# Altium schematic sheet Irrigation_ArduinoNode_v1.SchDoc
size 420 x 297 mm; SheetNumber: 1; SheetTotal: 1; SPICEModelCacheKOELNJHK: <root> / <DocumentId>KOELNJHK</DocumentId> / <CacheFrame Number="0"> / <Model Name="diode" Kind="MDL"> / <Text>*Default Diode / *Diode Pinout: A,K / .MODEL DIODE D()</Text> / </Model> / </CacheFrame> / </root>
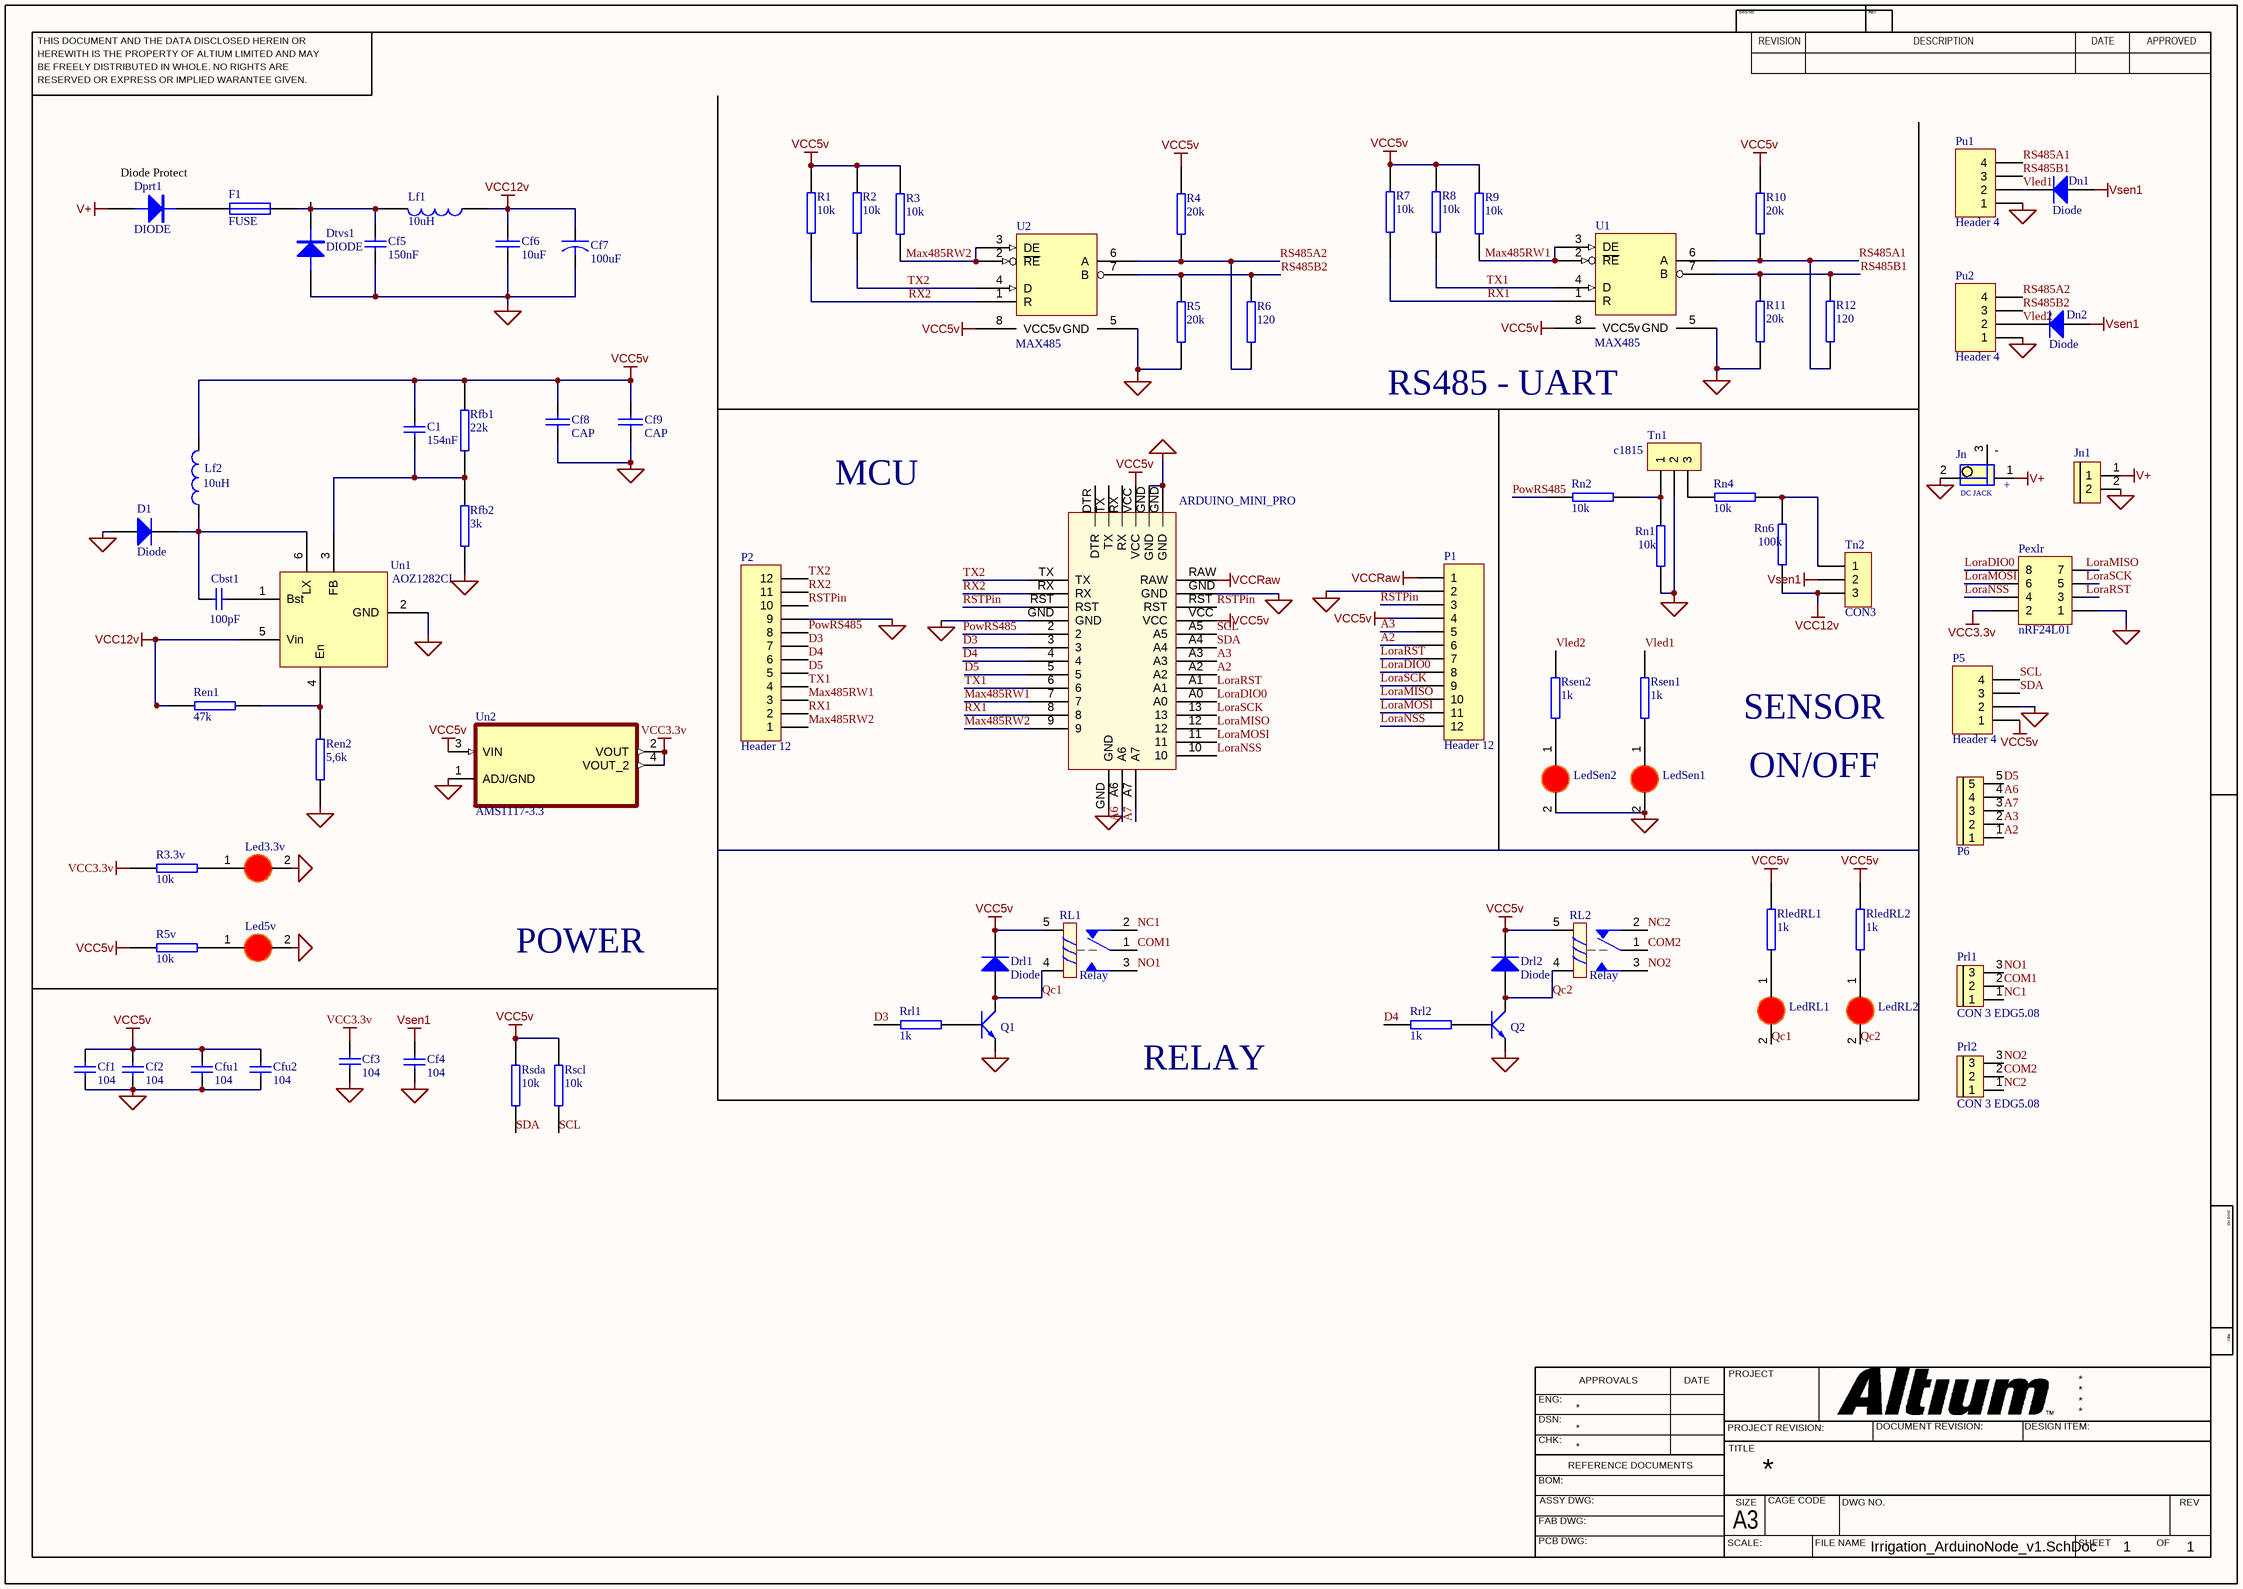
[diagram p0: Irrigation_ArduinoNode_v1.SchDoc]

## Parts
ARDUINO_MINI_PRO  (no value)  [ARDUINO_MINI_PRO]
C1  value 154nF  [0805c]
Cbst1  value 100pF  [0805c]
Cf1  104  [0805c]
Cf2  104  [0805c]
Cf3  104  [0805c]
Cf4  104  [0805c]
Cf5  value 150nF  [0805c]
Cf6  10uF  [1206e]
Cf7  100uF  [cc15r15]
Cf8  CAP  [1206e]
Cf9  CAP  [1206e]
Cfu1  104  [0805c]
Cfu2  104  [0805c]
D1  Diode  [Sma]
Dn1  Diode  [Sma]
Dn2  Diode  [Sma]
Dprt1  DIODE  [sma]
Drl1  Diode  [Sma]
Drl2  Diode  [Sma]
Dtvs1  DIODE  [smb]
F1  FUSE  [1812E]
Jn  (no value)  [CON3_129_PJ-002A_TH_RA]
Jn1  (no value)  [CON 2 HT3.96]
Led3.3v  (no value)  [LED-1206-Red]
Led5v  (no value)  [LED-1206-Red]
LedRL1  (no value)  [LED-1206-Red]
LedRL2  (no value)  [LED-1206-Red]
LedSen1  (no value)  [LED-1206-Red]
LedSen2  (no value)  [LED-1206-Red]
Lf1  10uH  [IND_SPR05x]
Lf2  value 10uH  [IND_SPR06xe]
P1  Header 12  [HDR1X12]
P2  Header 12  [HDR1X12]
P5  Header 4  [giacdung4]
P6  CON 5 EDG5.08  [CON 5 5EDG5.08]  (value not drawn)
Pexlr  nRF24L01  [HDR2X4]
Prl1  CON 3 EDG5.08  [CON 3 3EDG5.08]
Prl2  CON 3 EDG5.08  [CON 3 3EDG5.08]
Pu1  Header 4  [giacdung4]
Pu2  Header 4  [giacdung4]
Q1  (no value)  [SOT23-3]
Q2  (no value)  [SOT23-3]
R1  10k  [0805c]
R2  10k  [0805c]
R3  10k  [0805c]
R3.3v  10k  [0805c]
R4  20k  [0805c]
R5  20k  [0805c]
R5v  10k  [0805c]
R6  120  [0805c]
R7  10k  [0805c]
R8  10k  [0805c]
R9  10k  [0805c]
R10  20k  [0805c]
R11  20k  [0805c]
R12  120  [0805c]
Ren1  47k  [0805c]
Ren2  5,6k  [0805c]
Rfb1  22k  [0805c]
Rfb2  3k  [0805c]
RL1  Relay  [Relay 5 Chan SRD]
RL2  Relay  [Relay 5 Chan SRD]
RledRL1  1k  [0805c]
RledRL2  1k  [0805c]
Rn1  10k  [0805c]
Rn2  10k  [0805c]
Rn4  10k  [0805c]
Rn6  100k  [0805c]
Rrl1  1k  [0805c]
Rrl2  1k  [0805c]
Rscl  10k  [0805c]
Rsda  10k  [0805c]
Rsen1  1k  [0805c]
Rsen2  1k  [0805c]
Tn1  c1815  [sot23-3]
Tn2  CON3  [dpak]
U1  MAX485  [so-8]
U2  MAX485  [so-8]
Un1  AOZ1282CI  [SOT23-6]
Un2  AMS1117-3.3  [SOT230]

## Nets
GND: ARDUINO_MINI_PRO.GND Cf1.1 Cf2.1 Cf3.1 Cf4.1 Cf5.2 Cf6.2 Cf7.2 Cf8.2 Cf9.2 Cfu1.1 Cfu2.1 D1.1(A) Dtvs1.1(A) Jn.2 Jn1.2 Led3.3v.2(K) Led5v.2(K) LedSen1.2(K) LedSen2.2(K) P1.2 P2.9 P5.2 Pexlr.1 Pu1.1 Pu2.1 Q1.2(E) Q2.2(E) R5.1 R11.1 Ren2.1 Rfb2.1 Rn1.1 Tn1.2 U1.5(GND) U2.5(GND) Un1.2(GND) Un2.1(ADJ/GND)
V+: Dprt1.1(A) Jn.1 Jn1.1
VCC: ARDUINO_MINI_PRO.VCC C1.1 Cf1.2 Cf2.2 Cf8.1 Cf9.1 Cfu1.2 Cfu2.2 Drl1.2(K) Drl2.2(K) Lf2.2 P1.4 P5.1 R1.2 R2.2 R3.2 R4.2 R5v.1 R7.2 R8.2 R9.2 R10.2 Rfb1.2 RL1.5 RL2.5 RledRL1.1 RledRL2.1 Rscl.1 Rsda.1 U1.8(VCC5v) U2.8(VCC5v) Un2.3(VIN)  [also labelled VCC5v]
VCC3.3v: Cf3.2 Pexlr.2 R3.3v.1 Un2.2(VOUT) Un2.4(VOUT_2)
VCC12v: Cf6.1 Cf7.1 Lf1.2 Ren1.1 Rn6.1 Tn2.3 Un1.5(Vin)
VCCRaw: ARDUINO_MINI_PRO.RAW P1.1
Vsen1: Cf4.2 Dn1.1(A) Dn2.1(A) Tn2.2
A2: ARDUINO_MINI_PRO.A2 P1.6 P6.1
A3: ARDUINO_MINI_PRO.A3 P1.5 P6.2
A6: ARDUINO_MINI_PRO.A6 P6.4
A7: ARDUINO_MINI_PRO.A7 P6.3
COM1: Prl1.2 RL1.1
COM2: Prl2.2 RL2.1
D3: ARDUINO_MINI_PRO.3 P2.7 Rrl1.1
D4: ARDUINO_MINI_PRO.4 P2.6 Rrl2.1
D5: ARDUINO_MINI_PRO.5 P2.5 P6.5
LoraDIO0: ARDUINO_MINI_PRO.A0 P1.8 Pexlr.8
LoraMISO: ARDUINO_MINI_PRO.12 P1.10 Pexlr.7
LoraMOSI: ARDUINO_MINI_PRO.11 P1.11 Pexlr.6
LoraNSS: ARDUINO_MINI_PRO.10 P1.12 Pexlr.4
LoraRST: ARDUINO_MINI_PRO.A1 P1.7 Pexlr.3
LoraSCK: ARDUINO_MINI_PRO.13 P1.9 Pexlr.5
Max485RW1: ARDUINO_MINI_PRO.7 P2.3 R9.1 U1.2(~{RE}) U1.3(DE)
Max485RW2: ARDUINO_MINI_PRO.9 P2.1 R3.1 U2.2(~{RE}) U2.3(DE)
NC1: Prl1.1 RL1.2
NC2: Prl2.1 RL2.2
NO1: Prl1.3 RL1.3
NO2: Prl2.3 RL2.3
PowRS485: ARDUINO_MINI_PRO.2 P2.8 Rn2.1
Qc1: Drl1.1(A) LedRL1.2(K) Q1.3(C) RL1.4
Qc2: Drl2.1(A) LedRL2.2(K) Q2.3(C) RL2.4
RS485A1: Pu1.4 R10.1 R12.2 U1.6(A)
RS485A2: Pu2.4 R4.1 R6.2 U2.6(A)
RS485B1: Pu1.3 R11.2 R12.1 U1.7(B)
RS485B2: Pu2.3 R5.2 R6.1 U2.7(B)
RSTPin: ARDUINO_MINI_PRO.RST P1.3 P2.10
RX1: ARDUINO_MINI_PRO.8 P2.2 R7.1 U1.1(R)
RX2: ARDUINO_MINI_PRO.RX P2.11 R1.1 U2.1(R)
SCL: ARDUINO_MINI_PRO.A5 P5.4 Rscl.2
SDA: ARDUINO_MINI_PRO.A4 P5.3 Rsda.2
TX1: ARDUINO_MINI_PRO.6 P2.4 R8.1 U1.4(D)
TX2: ARDUINO_MINI_PRO.TX P2.12 R2.1 U2.4(D)
Vled1: Dn1.2(K) Pu1.2 Rsen1.1
Vled2: Dn2.2(K) Pu2.2 Rsen2.1
NetC1_2: C1.2 Rfb1.1 Rfb2.2 Un1.3(FB)
NetCbst1_1: Cbst1.1 Un1.1(Bst)
NetCbst1_2: Cbst1.2 D1.2(K) Lf2.1 Un1.6(LX)
NetCf5_1: Cf5.1 Dtvs1.2(K) F1.2 Lf1.1
NetDprt1_2: Dprt1.2(K) F1.1
NetLed3.3v_1: Led3.3v.1(A) R3.3v.2
NetLed5v_1: Led5v.1(A) R5v.2
NetLedRL1_1: LedRL1.1(A) RledRL1.2
NetLedRL2_1: LedRL2.1(A) RledRL2.2
NetLedSen1_1: LedSen1.1(A) Rsen1.2
NetLedSen2_1: LedSen2.1(A) Rsen2.2
NetQ1_1: Q1.1(B) Rrl1.2
NetQ2_1: Q2.1(B) Rrl2.2
NetRen1_2: Ren1.2 Ren2.2 Un1.4(En)
NetRn1_2: Rn1.2 Rn2.2 Tn1.1
NetRn4_1: Rn4.1 Tn1.3
NetRn4_2: Rn4.2 Rn6.2 Tn2.1

Not connected (* = marked no-connect by the designer): ARDUINO_MINI_PRO DTR; Jn 3(-)

## Notes on the sheet
- Diode Protect
- RS485 - UART
- MCU
- SENSOR
- ON/OFF
- POWER
- RELAY
- THIS DOCUMENT AND THE DATA DISCLOSED HEREIN OR
- HEREWITH IS THE PROPERTY OF ALTIUM LIMITED AND MAY
- DWG NO:
- REVISION
- REV:
- DESCRIPTION
- DATE
- APPROVED
- BE FREELY DISTRIBUTED IN WHOLE. NO RIGHTS ARE
- RESERVED OR EXPRESS OR IMPLIED WARANTEE GIVEN.
- ENG:
- APPROVALS
- PROJECT
- DSN:
- CHK:
- REFERENCE DOCUMENTS
- PROJECT REVISION:
- TITLE
- DOCUMENT REVISION:
- DESIGN ITEM:
- BOM:
- FAB DWG:
- PCB DWG:
- ASSY DWG:
- SCALE:
- A3
- SIZE
- CAGE CODE
- FILE NAME
- DWG NO.
- SHEET
- OF
- REV
- (in symbol CON-PLG_3X1-228-DC_JACK) +; DC JACK

## Library data of the parts
ARDUINO_MINI_PRO = ARDUINO_MINI_PRO
C1 Cbst1 Cf1-Cf5 Cfu1 Cfu2 = Cap: Capacitor; Published: 8-Jun-2000; LatestRevisionDate: 17-Jul-2002; LatestRevisionNote: Re-released for DXP Platform.; PackageReference: RAD-0.3; Publisher: Altium Limited
Cf6 Cf8 Cf9 = CAP: Capacitor
Cf7 = CAPACITOR
D1 Dn1 Dn2 Drl1 Drl2 = Diode: Default Diode; Published: 8-Jun-2000; LatestRevisionDate: 17-Jul-2002; LatestRevisionNote: Re-released for DXP Platform.; PackageVersion: Sep-1996; PackageReference: SMC; Publisher: Altium Limited; Code_JEDEC: DO-214-AB
F1 = FUSE1
Jn = CON-PLG_3X1-228-DC_JACK: 3 Pins, 1 Row 228mil Pitch, right angle Connector, male; Manufacturer: JST; Manufacturer Part Number: PJ-002A; Alternate Part Number-1: NA; Case/Package: TH-CON; Supplier-1: SP ROAD; Supplier Part Number-1: NA
Jn1 = CON 2 HT3.96: Cắm; Ma_Hang: MH000984; Ten_Linh_Kien: CON 2 HT3.96-2P 3.96MM (Cam Cong); Don_Vi: Con; Chung_Loai: Cắm; Ghi_Chu: *; Kieu_Chan: *
Led3.3v Led5v LedRL1 LedRL2 LedSen1 LedSen2 = LED 1206 Do: Dán; Don_Vi: Con; Ma_Hang: MH002334; Ten_Linh_Kien: LED1206 Màu Đỏ (Red); Ghi_Chu: *; Kieu_Chan: *; Chung_Loai: Dán
Lf1 = INDUCTOR
Lf2 = Inductor: Code_IEC: 1005; Published: 8-Jun-2000; LatestRevisionDate: 29-May-2009; LatestRevisionNote: IPC-7351 Footprint Added.; PackageReference: 0402-A; Publisher: Altium Limited; PackageDescription: Chip Inductor; Code_JEITA: 0402
P1 P2 = Header 12: Header, 12-Pin; LatestRevisionDate: 17-Jul-2002; LatestRevisionNote: Re-released for DXP Platform.; Publisher: Altium Limited
P5 Pu1 Pu2 = Header 4: Header, 4-Pin; LatestRevisionDate: 17-Jul-2002; LatestRevisionNote: Re-released for DXP Platform.; Publisher: Altium Limited
P6 = CON 5 EDG5.08: Cắm; Ten_Linh_Kien: CON 5 2EDG5.08-5P 5.08MM ( Xanh Cong); Ma_Hang: MH003589; Kieu_Chan: *; Don_Vi: Con; Ghi_Chu: *; Chung_Loai: Cắm
Pexlr = Header 4X2: Header, 4-Pin, Dual row; LatestRevisionDate: 17-Jul-2002; LatestRevisionNote: Re-released for DXP Platform.; Publisher: Altium Limited
Prl1 Prl2 = CON 3 EDG5.08: Cắm; Ten_Linh_Kien: CON 3 2EDG5.08-3P 5.08MM ( Xanh Cong); Ma_Hang: MH000760; Ghi_Chu: *; Kieu_Chan: *; Don_Vi: Con; Chung_Loai: Cắm
Q1 Q2 = Trans C1815 HF SMD: SOT-23; Value: C9014
R1-R3 R3.3v R4 R5 R5v R6-R12 Ren1 Ren2 Rfb1 Rfb2 RledRL1 RledRL2 Rn1 Rn2 Rn4 Rn6 Rrl1 Rrl2 Rscl Rsda Rsen1 Rsen2 = RES2
RL1 RL2 = Relay 5 Chan SRD: Relay 5 Chan; Ma_Hang: MH009374; Ten: Relay 5V10A SRD-05VDC-SL-C Chính Hãng
Tn1 Tn2 = CON3: Connector
U1 U2 = DS36F95: DIFFERENTIAL BUS TRANSCEIVERS
Un1 = AOZ1282CI: AOZ1282
Un2 = LM1117-3.3: Regulador de tensÃ£o linear IC 1 Output 800mA SOT-223-4; MF: Texas Instruments; MP: LM1117-3.3; Package: SOT-223-4 Texas Instruments; Price: None; Availability: Unavailable; SnapEDA_Link: https://www.snapeda.com/parts/LM1117-3.3/Texas%20Instruments/view-part/549181/?ref=snap; Value: *